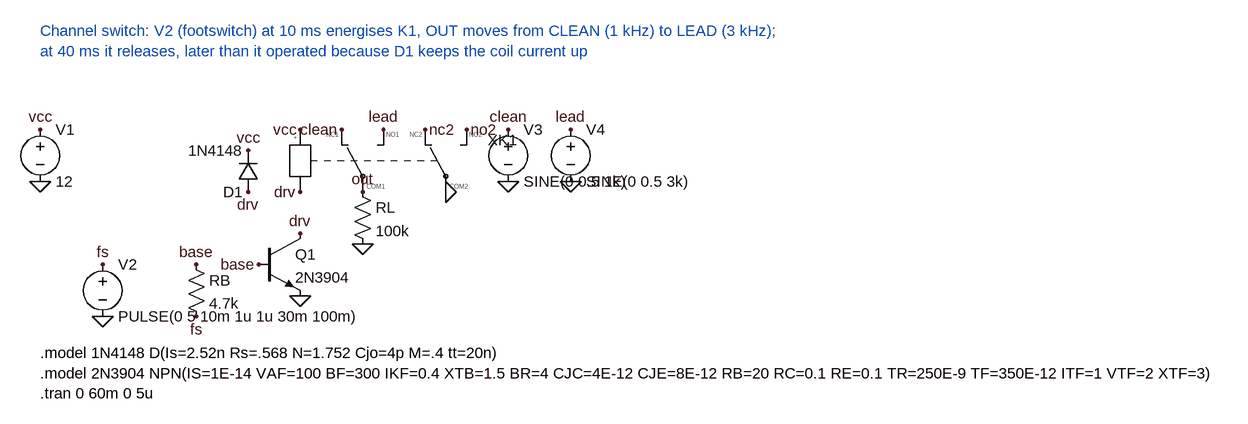
[diagram p0: schematic demo_relay.asc]
demo_relay.asc, the LTspice schematic file:
Version 4
SHEET 1 1000 520
FLAG 0 112 vcc
FLAG 0 192 0
FLAG 400 112 vcc
FLAG 400 208 drv
FLAG 464 112 clean
FLAG 528 112 lead
FLAG 496 208 out
FLAG 592 112 nc2
FLAG 656 112 no2
FLAG 624 208 0
FLAG 496 288 0
FLAG 320 208 drv
FLAG 320 144 vcc
FLAG 400 272 drv
FLAG 336 320 base
FLAG 400 368 0
FLAG 240 320 base
FLAG 240 400 fs
FLAG 96 320 fs
FLAG 96 400 0
FLAG 720 112 clean
FLAG 720 192 0
FLAG 816 112 lead
FLAG 816 192 0
SYMBOL voltage 0 96 R0
SYMATTR InstName V1
SYMATTR Value 12
SYMBOL G5V_2_DC12 400 96 R0
SYMATTR InstName XK1
SYMBOL res 480 192 R0
SYMATTR InstName RL
SYMATTR Value 100k
SYMBOL diode 336 208 R180
SYMATTR InstName D1
SYMATTR Value 1N4148
SYMBOL npn 336 272 R0
SYMATTR InstName Q1
SYMATTR Value 2N3904
SYMBOL res 224 304 R0
SYMATTR InstName RB
SYMATTR Value 4.7k
SYMBOL voltage 96 304 R0
SYMATTR InstName V2
SYMATTR Value PULSE(0 5 10m 1u 1u 30m 100m)
SYMBOL voltage 720 96 R0
SYMATTR InstName V3
SYMATTR Value SINE(0 0.5 1k)
SYMBOL voltage 816 96 R0
SYMATTR InstName V4
SYMATTR Value SINE(0 0.5 3k)
TEXT 0 456 Left 2 !.model 1N4148 D(Is=2.52n Rs=.568 N=1.752 Cjo=4p M=.4 tt=20n)\n.model 2N3904 NPN(IS=1E-14 VAF=100 BF=300 IKF=0.4 XTB=1.5 BR=4 CJC=4E-12 CJE=8E-12 RB=20 RC=0.1 RE=0.1 TR=250E-9 TF=350E-12 ITF=1 VTF=2 XTF=3)\n.tran 0 60m 0 5u
TEXT 0 -40 Left 2 ;Channel switch: V2 (footswitch) at 10 ms energises K1, OUT moves from CLEAN (1 kHz) to LEAD (3 kHz);\nat 40 ms it releases, later than it operated because D1 keeps the coil current up

The netlist it stands for:
* demo_relay.asc
V1 vcc 0 12
XXK1 vcc drv out clean lead 0 nc2 no2 G5V_2_DC12  ; pins COIL+ COIL- COM1 NC1 NO1 COM2 NC2 NO2
RL out 0 100k
D1 drv vcc 1N4148
Q1 drv base 0 0 2N3904
RB base fs 4.7k
V2 fs 0 PULSE(0 5 10m 1u 1u 30m 100m)
V3 clean 0 SINE(0 0.5 1k)
V4 lead 0 SINE(0 0.5 3k)
.model D D
.lib standard.dio
.model NPN NPN
.model PNP PNP
.lib standard.bjt
.model 1N4148 D(Is=2.52n Rs=.568 N=1.752 Cjo=4p M=.4 tt=20n)
.model 2N3904 NPN(IS=1E-14 VAF=100 BF=300 IKF=0.4 XTB=1.5 BR=4 CJC=4E-12 CJE=8E-12 RB=20 RC=0.1 RE=0.1 TR=250E-9 TF=350E-12 ITF=1 VTF=2 XTF=3)
.tran 0 60m 0 5u
* Channel switch: V2 (footswitch) at 10 ms energises K1, OUT moves from CLEAN (1 kHz) to LEAD (3 kHz);
* at 40 ms it releases, later than it operated because D1 keeps the coil current up
.lib relay.sub
.backanno
.end